# Altium schematic sheet blinds.SchDoc
size A3
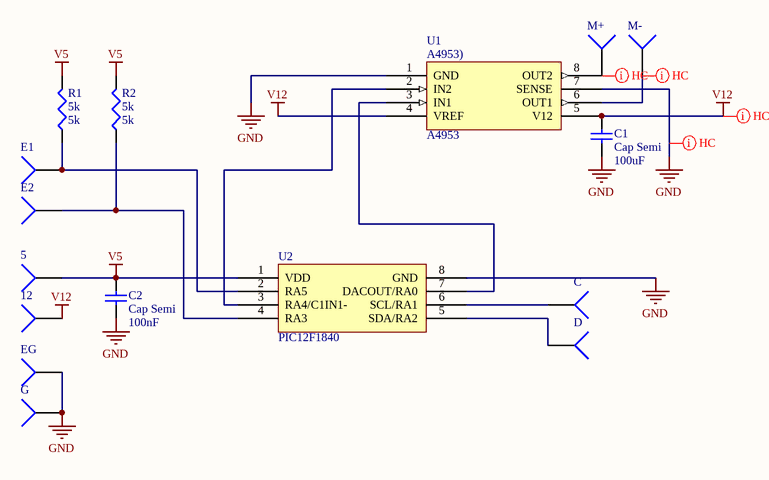
[diagram p0: blinds.SchDoc]

## Parts
5  Socket  [PIN1L]  (value not drawn)
12  Socket  [PIN1L]  (value not drawn)
C  Socket  [PIN1L]  (value not drawn)
C1  Cap Semi  value 100uF  [C1206]
C2  Cap Semi  value 100nF  [1608[0603]]
D  Socket  [PIN1L]  (value not drawn)
E1  Socket  [PIN1L]  (value not drawn)
E2  Socket  [PIN1L]  (value not drawn)
EG  Socket  [PIN1L]  (value not drawn)
G  Socket  [PIN1L]  (value not drawn)
M+  Socket  [PIN1L]  (value not drawn)
M-  Socket  [PIN1L]  (value not drawn)
R1  5k  [J1-0603]
R2  5k  [J1-0603]
U1  A4953  [SOIC150-8_N]
U2  PIC12F1840  [SOIC150-8_N]

## Nets
GND: C1.1 C2.1 EG.1 G.1 U1.1(GND) U1.7(SENSE) U2.8(GND)
V5: 5.1 C2.2 R1.2 R2.2 U2.1(VDD)
V12: 12.1 C1.2 U1.4(VREF) U1.5(V12)
NetC_1: C.1 U2.6(SCL/RA1)
NetD_1: D.1 U2.5(SDA/RA2)
NetE1_1: E1.1 R1.1 U2.2(RA5)
NetE2_1: E2.1 R2.1 U2.4(RA3)
NetM+_1: M+.1 U1.8(OUT2)
NetM-_1: M-.1 U1.6(OUT1)
NetU1_2: U1.2(IN2) U2.3(RA4/C1IN1-)
NetU1_3: U1.3(IN1) U2.7(DACOUT/RA0)

## Layout directives
net class HC: GND, NetM+_1, NetM-_1, V12

## Notes on the sheet
- (in symbol A4953) A4953)

## Library data of the parts
C1 C2 = Cap Semi: Capacitor (Semiconductor SIM Model); Published: 8-Jun-2000; LatestRevisionDate: 29-May-2009; LatestRevisionNote: IPC-7351 Footprint Added.; PackageReference: C1206; Publisher: Altium Limited; PackageDescription: Chip Capacitor
R1 R2 = Res3: Resistor; Published: 8-Jun-2000; LatestRevisionDate: 29-May-2009; LatestRevisionNote: IPC-7351 Footprint Added.; PackageReference: J1-0603; Publisher: Altium Limited; PackageDescription: Chip Resistor; Value: 5k
5 12 C D E1 E2 EG G M+ M- = Socket: LatestRevisionDate: 17-Jul-2002; LatestRevisionNote: Re-released for DXP Platform.; Publisher: Altium Limited